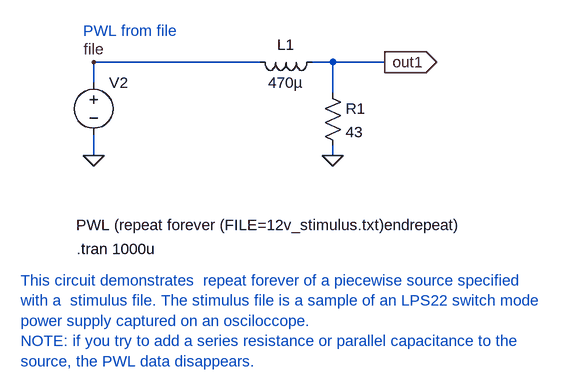
[diagram p0: schematic 12Vpsu+filter LR.asc]
12Vpsu+filter LR.asc, the LTspice schematic file:
Version 4
SHEET 1 880 760
WIRE -960 336 -960 304
WIRE -960 416 -960 448
WIRE -960 304 -704 304
WIRE -512 304 -592 304
WIRE -592 432 -592 448
WIRE -592 352 -592 304
WIRE -592 304 -624 304
FLAG -960 304 file
FLAG -960 448 0
FLAG -512 304 out1
IOPIN -512 304 Out
FLAG -592 448 0
SYMBOL ind -608 288 R90
WINDOW 0 5 56 VBottom 0
WINDOW 3 32 56 VTop 0
SYMATTR InstName L1
SYMATTR Value 470µ
SYMATTR SpiceLine Ipk=3 Rser=0.063
SYMBOL res -608 336 R0
SYMATTR InstName R1
SYMATTR Value 43
SYMATTR SpiceLine pwr=0.25
SYMBOL voltage -960 320 R0
WINDOW 123 0 0 Left 0
WINDOW 39 0 0 Left 0
WINDOW 3 -27 235 Left 0
SYMATTR Value PWL (repeat forever (FILE=12v_stimulus.txt)endrepeat)
SYMATTR InstName V2
TEXT -976 256 Left 0 ;PWL from file
TEXT -986 592 Left 0 !.tran 1000u
TEXT -1072 640 Left 0 ;This circuit demonstrates  repeat forever of a piecewise source specified\nwith a  stimulus file. The stimulus file is a sample of an LPS22 switch mode \npower supply captured on an osciloccope.\nNOTE: if you try to add a series resistance or parallel capacitance to the \nsource, the PWL data disappears.

The netlist it stands for:
* 12Vpsu+filter LR.asc
L1 out1 file 470µ Ipk=3 Rser=0.063
R1 out1 0 43 pwr=0.25
V2 file 0 PWL (repeat forever (FILE=12v_stimulus.txt)endrepeat)
* PWL from file
.tran 1000u
* This circuit demonstrates  repeat forever of a piecewise source specified
* with a  stimulus file. The stimulus file is a sample of an LPS22 switch mode
* power supply captured on an osciloccope.
* NOTE: if you try to add a series resistance or parallel capacitance to the
* source, the PWL data disappears.
.backanno
.end